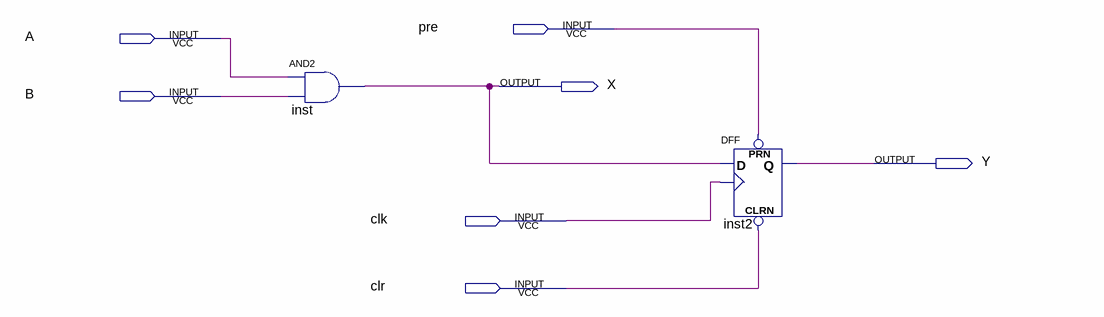
[diagram p0: schematic sheet]
// Quartus schematic expt9.bdf as structural Verilog: 2 symbols, 7 pins
module expt9 (
  input  pre,
  input  A,
  input  B,
  input  clk,
  input  clr,
  output X,
  output Y
);

  and inst (X, A, B);
  DFF inst2 (.CLRN(clr), .CLK(clk), .D(X), .PRN(pre), .Q(Y));
endmodule
